# EasyEDA Pro project 毕设.eprj, schematic Schematic1
Board Name: 通信板; Create Date: 2025-01-23; Page Name: P1; Project Name: 毕设; Schematic Name: Schematic1; Update Date: 2025-04-09; Company: 嘉立创EDA; Page Size: A4; Version: V1.0
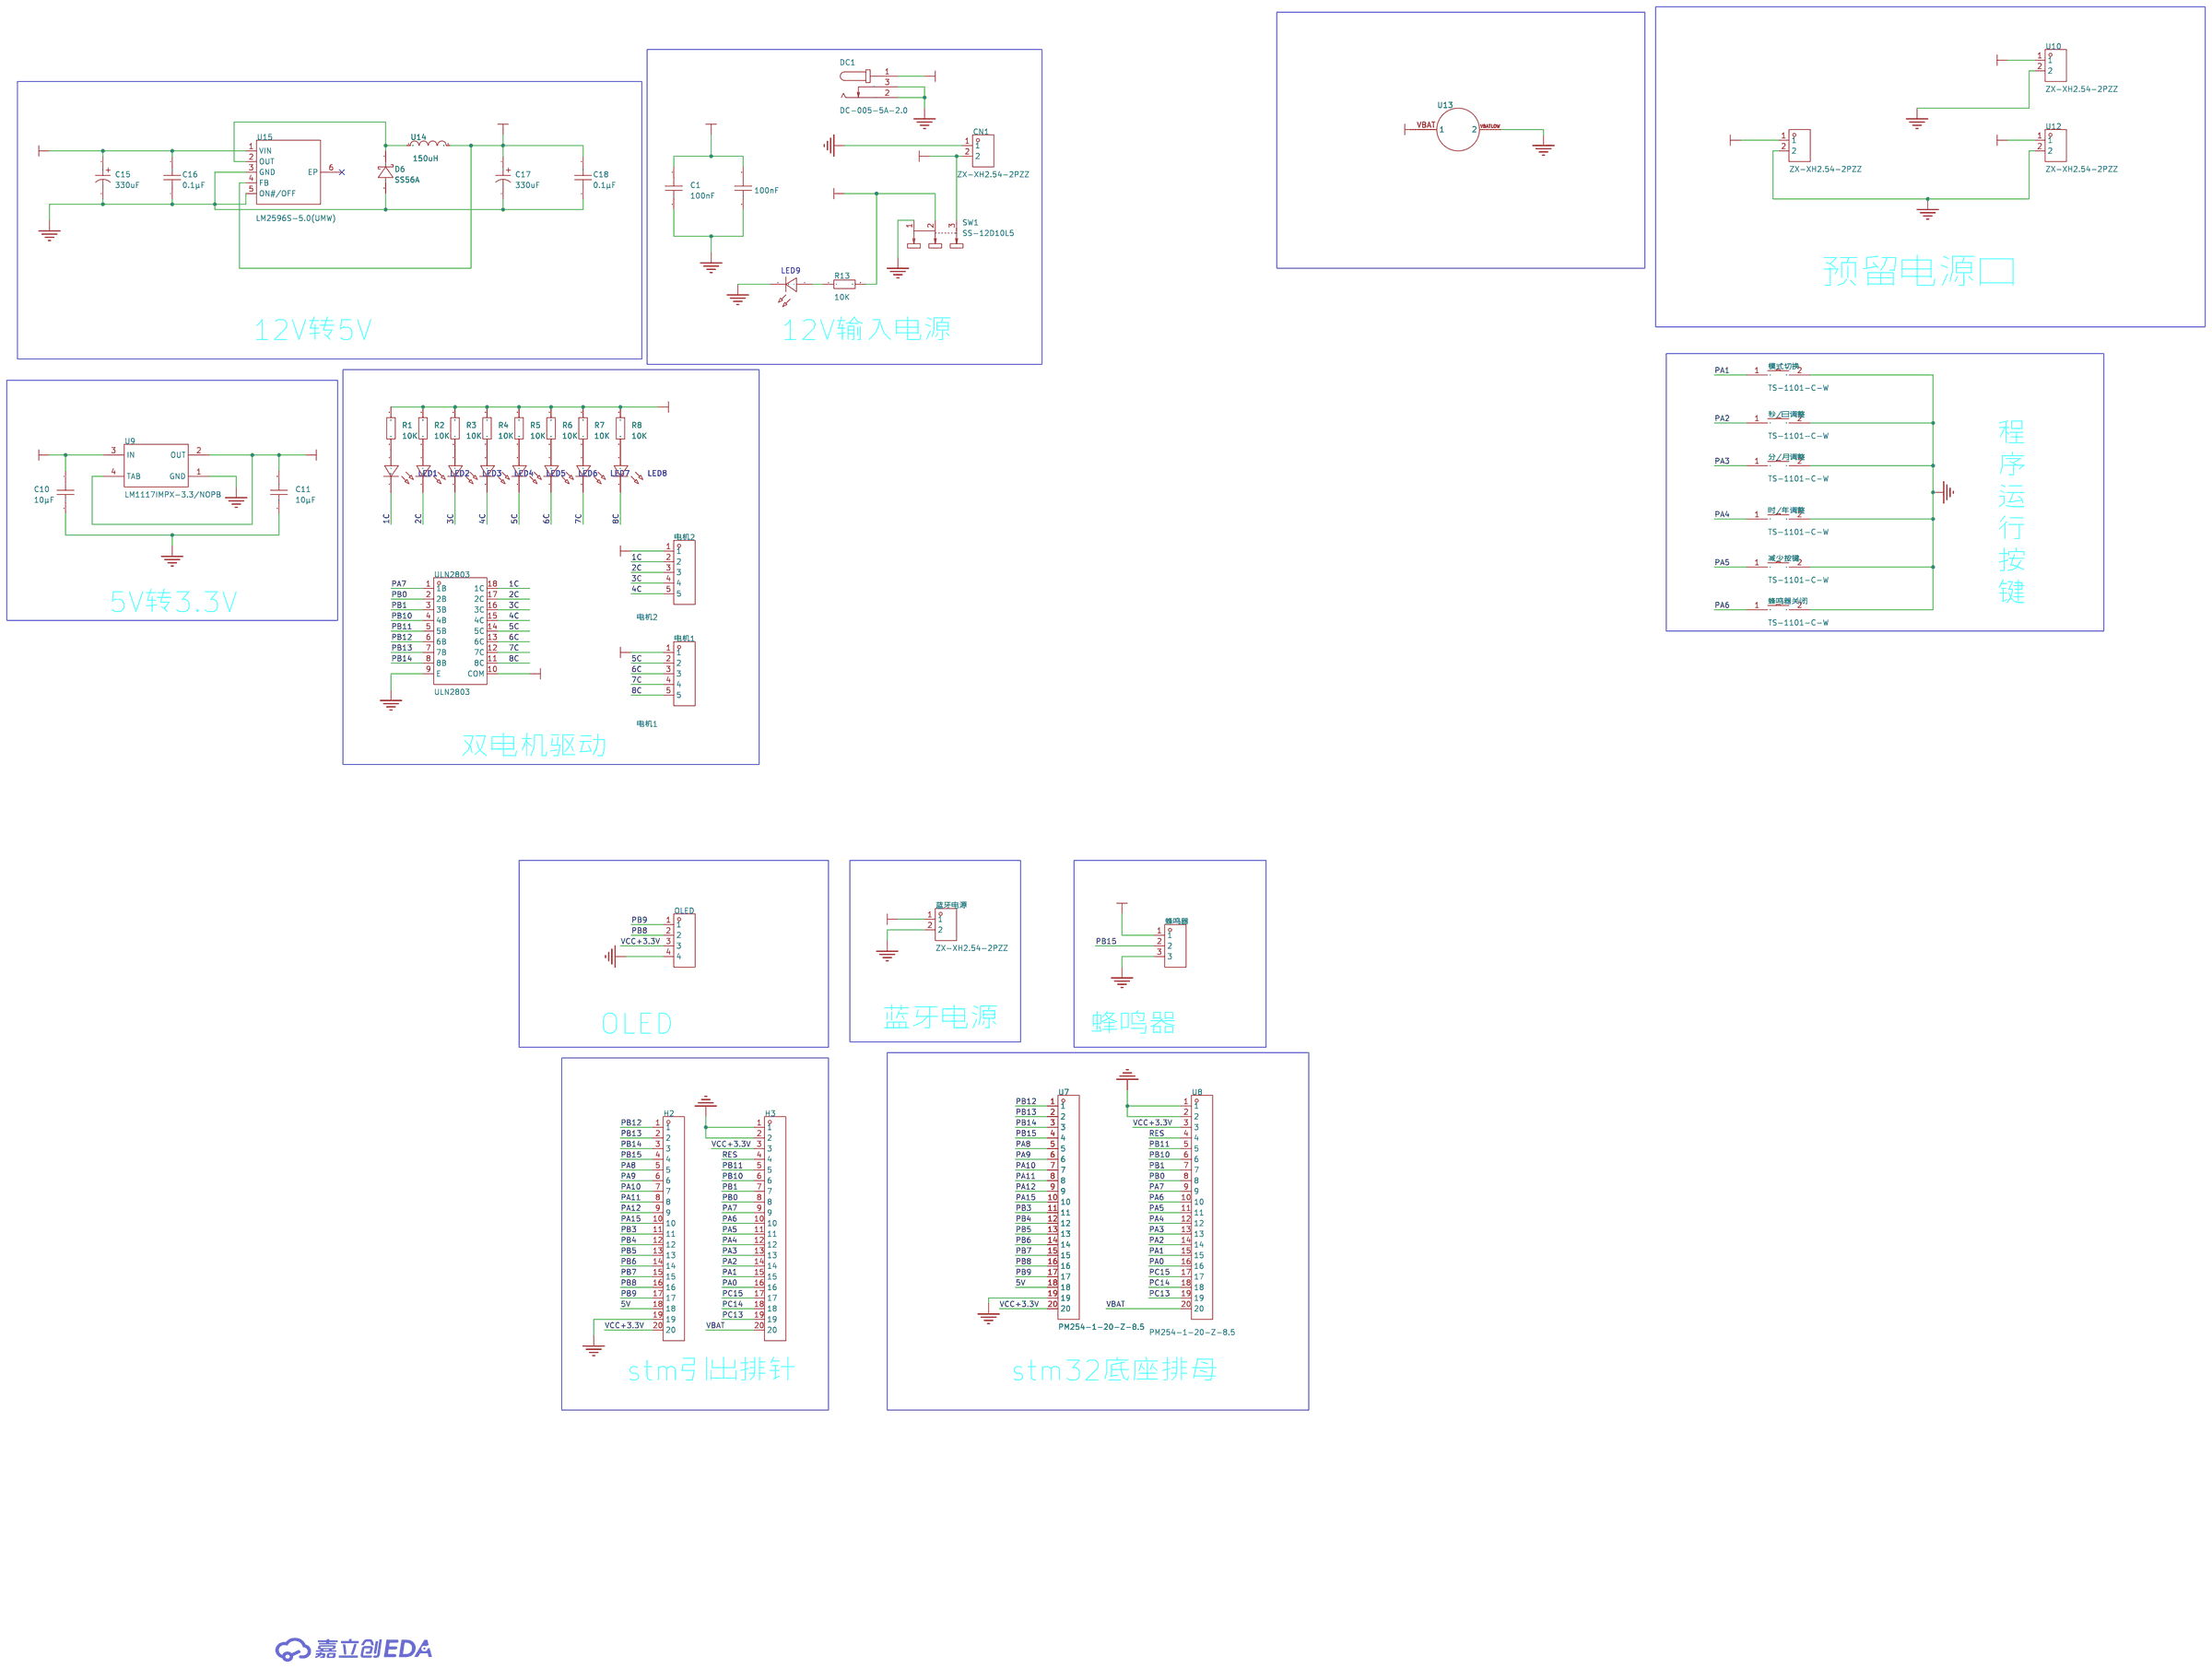
[diagram p0: schematic sheet]

## Parts
C1  100nF  [C0603]
C2  100nF  [C0603]
C10  10μF  [C0603]
C11  10μF  [C0603]
C15  330uF  [CAP-SMD_BD10.0-L10.3-W10.3-LS11.0-R-RD]
C16  0.1μF  [C0603]
C17  330uF  [CAP-SMD_BD10.0-L10.3-W10.3-LS11.0-R-RD]
C18  0.1μF  [C0603]
CN1  ZX-XH2.54-2PZZ  [CONN-TH_2P-P2.50_HX25003-2A]
D6  SS56A  [SMA_L4.2-W2.6-LS5.0-RD]
DC1  DC-005-5A-2.0  [DC-IN-TH_DC-005-5A-2.0]
H2  -  [HDR-TH_20P-P2.54-V-M-1]
H3  -  [HDR-TH_20P-P2.54-V-M-1]
LED1  -  [LED_0603]
LED2  -  [LED_0603]
LED3  -  [LED_0603]
LED4  -  [LED_0603]
LED5  -  [LED_0603]
LED6  -  [LED_0603]
LED7  -  [LED_0603]
LED8  -  [LED_0603]
LED9  -  [LED_0603]
OLED  -  [HDR-TH_4P-P2.54-V-F]
R1  10K  [R0603]
R2  10K  [R0603]
R3  10K  [R0603]
R4  10K  [R0603]
R5  10K  [R0603]
R6  10K  [R0603]
R7  10K  [R0603]
R8  10K  [R0603]
R13  10K  [R0603]
SW1  SS-12D10L5  [SW-TH_SS-12D10L5]
U7  PM254-1-20-Z-8.5  [HDR-TH_20P-P2.54-V-F-2]
U8  PM254-1-20-Z-8.5  [HDR-TH_20P-P2.54-V-F-2]
U9  LM1117IMPX-3.3/NOPB  [SOT-223_L6.5-W3.5-P2.30-LS7.0-BR]
U10  ZX-XH2.54-2PZZ  [CONN-TH_2P-P2.50_HX25003-2A]
U11  ZX-XH2.54-2PZZ  [CONN-TH_2P-P2.50_HX25003-2A]
U12  ZX-XH2.54-2PZZ  [CONN-TH_2P-P2.50_HX25003-2A]
U13  -  [纽扣]
U14  150uH  [IND-SMD_L12.0-W12.0_CDRH125L125NP-470MC]
U15  LM2596S-5.0(UMW)  [TO-263-5_L10.2-W8.9-P1.70-BR]
ULN2803  ULN2803  [SOP-18_L11.6-W7.5-P1.27-LS10.3-BL]
减少按键  TS-1101-C-W  [SW-SMD_L6.0-W3.3-LS8.0]
分/月调整  TS-1101-C-W  [SW-SMD_L6.0-W3.3-LS8.0]
时/年调整  TS-1101-C-W  [SW-SMD_L6.0-W3.3-LS8.0]
模式切换  TS-1101-C-W  [SW-SMD_L6.0-W3.3-LS8.0]
电机1  电机1  [CONN-TH_5P-P2.50_ZX-XH2.54-5PZZ]
电机2  电机2  [CONN-TH_5P-P2.50_ZX-XH2.54-5PZZ]
秒/日调整  TS-1101-C-W  [SW-SMD_L6.0-W3.3-LS8.0]
蓝牙电源  ZX-XH2.54-2PZZ  [CONN-TH_2P-P2.50_HX25003-2A]
蜂鸣器  -  [HDR-TH_3P-P2.54-V-F]
蜂鸣器关闭  TS-1101-C-W  [SW-SMD_L6.0-W3.3-LS8.0]

## Library data of the parts
C1 C2 C10 C11 C16 C18 = CAP_0603: Supplier Footprint: 0603
C15 C17 = EEEFT1H331GP: 容值:330uF;精度:±20%;额定电压:50V;纹波电流:900mA@100kHz;等效串联电阻:120mΩ@100kHz;; LCSC Part Name: 330uF ±20% 50V; Supplier Part: C542207; Manufacturer: PANASONIC(松下); Supplier Footprint: SMD; JLCPCB Part Class: 扩展库; Datasheet: https://atta.szlcsc.com/upload/public/pdf/source/20200908/C542207_1ADA45A6A347253BF2D7BDFE52AF5AB9.pdf; Supplier: LCSC; Tolerance: ±20%; Rated Voltage: 50V; Ripple Current: 900mA@100kHz; Equivalent Series Resistance(ESR): 120mΩ@100kHz; Lifetime @ Temp: 5000hrs@105℃; Operating Temperature: -55℃~+105℃
CN1 U10-U12 蓝牙电源 = ZX-XH2.54-2PZZ: LCSC Part Name: 1x2P 间距:2.5mm 直插 系列:XH; Supplier Part: C7429632; Manufacturer: Megastar(兆星); Supplier Footprint: 插件,P=2.5mm; JLCPCB Part Class: 扩展库; Datasheet: https://atta.szlcsc.com/upload/public/pdf/source/20230619/19BA6947230AA44A04D3EDD65E618FD0.pdf; Supplier: LCSC; Pins Structure: 1x2P; Pitch: 2.5mm; Mounting Type: 直插; Reference Series: XH; Number of Pins: 2P; Number of Rows: 1; Number of PINs Per Row: 2; Rated Current: 3A; Contact Material: 黄铜; Contact Plating: 锡; Operating Temperature: -25℃~+85℃; Rated Voltage (Max): 250V; Plastic Material: PA66; Flame Retardant Rating: UL94V-0; Color: 白色; Z-Height of the Board: 7mm; X-Length of Bottom Edge on Board (Spacing Line): 7.5mm; Y-Width of Bottom Edge on Board: 5.9mm
D6 = SS56A: 二极管配置:独立式;正向压降(Vf):700mV@5A;直流反向耐压(Vr):60V;整流电流:5A;; LCSC Part Name: 电压:60V 电流:5A; Supplier Part: C842793; Manufacturer: FUXINSEMI(富芯森美); Supplier Footprint: SMA(DO-214AC); JLCPCB Part Class: 扩展库; Datasheet: https://atta.szlcsc.com/upload/public/pdf/source/20200930/C842792_5106C80DF0E850BA03D1CC0EA757AD9D.pdf; Supplier: LCSC; Diode Configuration: 独立式; Forward Voltage (Vf@If): 700mV@5A; Reverse Voltage (Vr): 60V; Rectified Current: 5A; Reverse Leakage Current (Ir): 500nA
DC1 = DC-005-5A-2.0: LCSC Part Name: DC电源插座 内径:2mm 外径:6.2mm; Supplier Part: C381116; Manufacturer: XKB Connection(中国星坤); Supplier Footprint: 插件; JLCPCB Part Class: 扩展库; Datasheet: https://atta.szlcsc.com/upload/public/pdf/source/20211015/707A35F7AB6E89C57AAB641950105BB7.pdf; Supplier: LCSC; Connector Type: DC电源插座; Mounting Style: 弯插; Inside Contact Diameter: 2mm; Outside Contact Diameter: 6.2mm; Current Rating (Max): 5A; Voltage Rating (Max): 24V; Operating Temperature Range: -20℃~+70℃
H2 H3 = HDR-M_2.54_1x20P: Supplier Part: C50981; Supplier Footprint: 插件
LED1-LED9 = LED_0603-G: Supplier Footprint: 0603
